# Altium schematic sheet Hochsetzsteller.SchDoc
size A4; SheetNumber: 6; SheetTotal: 7
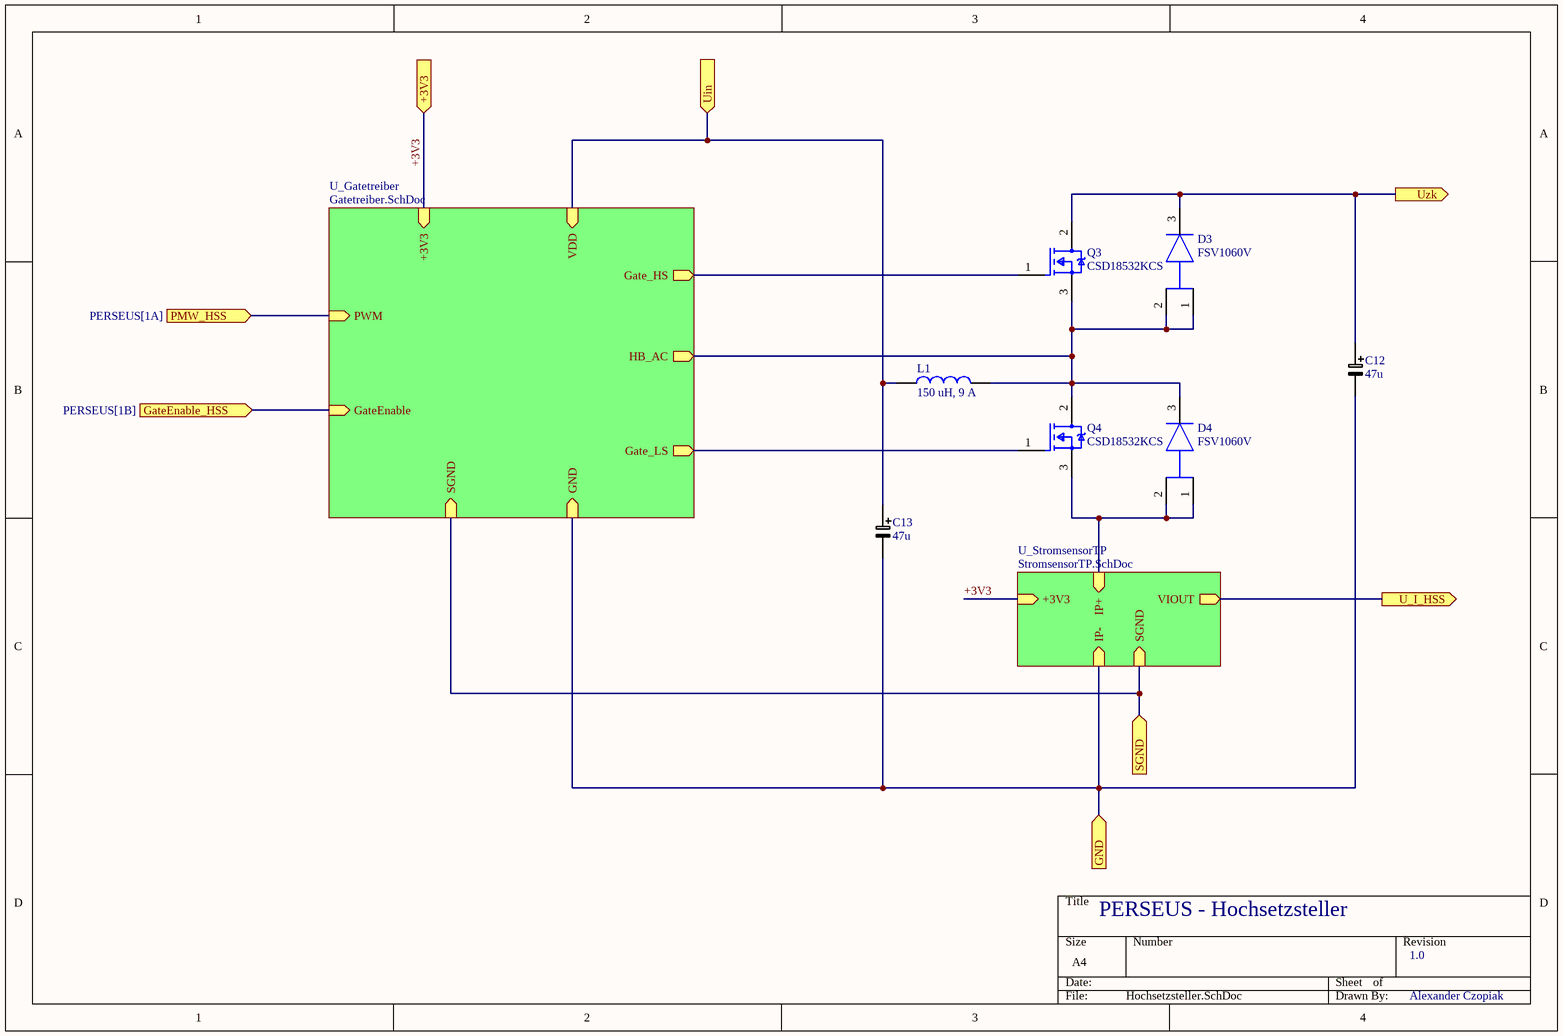
[diagram p0: Hochsetzsteller.SchDoc]

## Parts
C12  47u  [ELKO_5MM_D12.5MM]
C13  47u  [ELKO_5MM_D12.5MM]
D3  FSV1060V  [FP-340BQ-MFG]
D4  FSV1060V  [FP-340BQ-MFG]
L1  150 uH, 9 A  [WE-HCF_2920_Litz]
Q3  CSD18532KCS  [FP-PG-TO220-3-MFG]
Q4  CSD18532KCS  [FP-PG-TO220-3-MFG]

## Sub-sheets
U_Gatetreiber = Gatetreiber.SchDoc: PWM (in), GateEnable (in), Gate_HS (out), HB_AC (out), Gate_LS (out), VDD (in), +3V3 (in), GND (in), SGND (in)
U_StromsensorTP = StromsensorTP.SchDoc: IP+ (in), IP- (in), VIOUT (out), SGND (in), +3V3 (in)

## Ports
+3V3 (in, see PERSEUS[1A], Gatetreiber[1B], Halbbruecke[2B], SpannungssensorTP[4B], StromsensorTP[3B]), GateEnable_HSS (in, see PERSEUS[1B]), GND (in, see PERSEUS[1B], Gatetreiber[3D], Halbbruecke[3D]), PMW_HSS (in, see PERSEUS[1A]), SGND (in, see PERSEUS[1B], Gatetreiber[1D], Halbbruecke[2D], SpannungssensorTP[3C], StromsensorTP[3C]), U_I_HSS (out, see PERSEUS[1B]), Uin (in, see PERSEUS[1A]), Uzk (out, see PERSEUS[1A], Halbbruecke[3B])

## Nets
+3V3: port +3V3, sheet U_StromsensorTP/+3V3, sheet U_Gatetreiber/+3V3
GateEnable_HSS: port GateEnable_HSS, sheet U_Gatetreiber/GateEnable
GND: C12.2 C13.2 ; port GND, sheet U_StromsensorTP/IP-, sheet U_Gatetreiber/GND
PMW_HSS: port PMW_HSS, sheet U_Gatetreiber/PWM
SGND: port SGND, sheet U_StromsensorTP/SGND, sheet U_Gatetreiber/SGND
U_I_HSS: port U_I_HSS, sheet U_StromsensorTP/VIOUT
Uin: C13.1 L1.1 ; port Uin, sheet U_Gatetreiber/VDD
Uzk: C12.1 D3.3(C) Q3.2(DRAIN) ; port Uzk
NetD3_1: D3.1(Anode_1) D3.2(Anode_2) D4.3(C) L1.2 Q3.3(SOURCE) Q4.2(DRAIN) ; sheet U_Gatetreiber/HB_AC
NetD4_1: D4.1(Anode_1) D4.2(Anode_2) Q4.3(SOURCE) ; sheet U_StromsensorTP/IP+
NetQ3_1: Q3.1(GATE) ; sheet U_Gatetreiber/Gate_HS
NetQ4_1: Q4.1(GATE) ; sheet U_Gatetreiber/Gate_LS

## Notes on the sheet
- PERSEUS - Hochsetzsteller
- 1.0
- Alexander Czopiak

## Library data of the parts
C12 C13 = ELKO_THT: Kondensator Elektrolyt
D3 D4 = CMP-07162-000018-1: DIODE SCHOTTKY 60V 10A TO277-3; Manufacturer: ON Semiconductor; Max Junction Temp: +150°C; Max Surge Forward Current: 280A; Peak Reverse Current: 0.056mA; Capacitance: 550pF; Value: 550pF; Device Class L2: Diodes; RoHS: TRUE; Lead Free: Yes; Temperature Range High: +150°C; ComponentLink2URL: https://www.onsemi.com/pub/Collateral/FSV1060V-D.pdf; Temperature Range Low: -55°C; Max Repetitive Reverse Voltage: 60V; Footprint Url: https://www.onsemi.com/pub/Collateral/340BQ.PDF; Reverse Voltage: 60V; Device Class L1: Discrete Semiconductors; Octopart: https://octopart.com/fsv1060v-on+semiconductor-84328651; Height: 1.2mm; Digikey Description: DIODE SCHOTTKY 60V 10A TO277-3; ComponentLink2Description: Datasheet; Manufacturer Part Number: FSV1060V; Temperature: -55°C to +150°C; Package: 340BQ; Device Class L3: Schottky Diodes; Forward Current: 10A; Automotive: No; Mouser Description: Schottky Diodes & Rectifiers Schottky; Category: Diode
L1 = Induktivitaet SMD: SMT High Current Inductor WE-HCF, size 2920, 150 uH, 8.4 A; Part Number: 74437429203151; Rated Current: 8.4 A; Inductance: 150 uH; DC Resistance max.: 42.74 mOhm; Self Resonant Frequency: 3.8 MHz; Saturation Current: 7.8 A; ComponentLink1Description: Manufacturer; ComponentLink1URL: http://www.we-online.de; ComponentLink2Description: Datasheet; ComponentLink2URL: https://katalog.we-online.de/pbs/datasheet/74437429203151.pdf; Published Date: November 2018; Publisher: Wurth Elektronik; Size: 2920; Operating Temperature: -40 to 125 degC; Mounting Technology: SMT; Packaging: Tape and Reel
Q3 Q4 = CMP-32901-001154-1: MOSFET N-CH 60V 100A TO220; Polarization: N; Power Dissipation: 115W; Rds On Max: 16.5mR; Gate to Source Voltage (Vgs): 20V; Continuous Drain Current (ID): 55A; Threshold Voltage: 4V; Turn-On Delay Time: 13ns; Element Configuration: Single; Input Capacitance: 1.812nF; Turn-Off Delay Time: 40ns; Mount: Through Hole; Drain to Source Voltage (Vdss): 60V; Max Dual Supply Voltage: 60V; Length: 0.42inch; Height: 0.65inch; Width: 0.19inch; Packaging: Rail/Tube; Halogen Free: Halogen Free; Number of Pins: 3; Drain to Source Resistance: 16.5mR; Series: HEXFET®; RoHS Compliant: Yes; Reach SVHC Compliant: Yes; Drain to Source Breakdown Voltage: 60V; Max Operating Temperature: 175°C; Case/Package: TO-220; Max Power Dissipation: 115W; Lead Free: Lead Free; Min Operating Temperature: -55°C